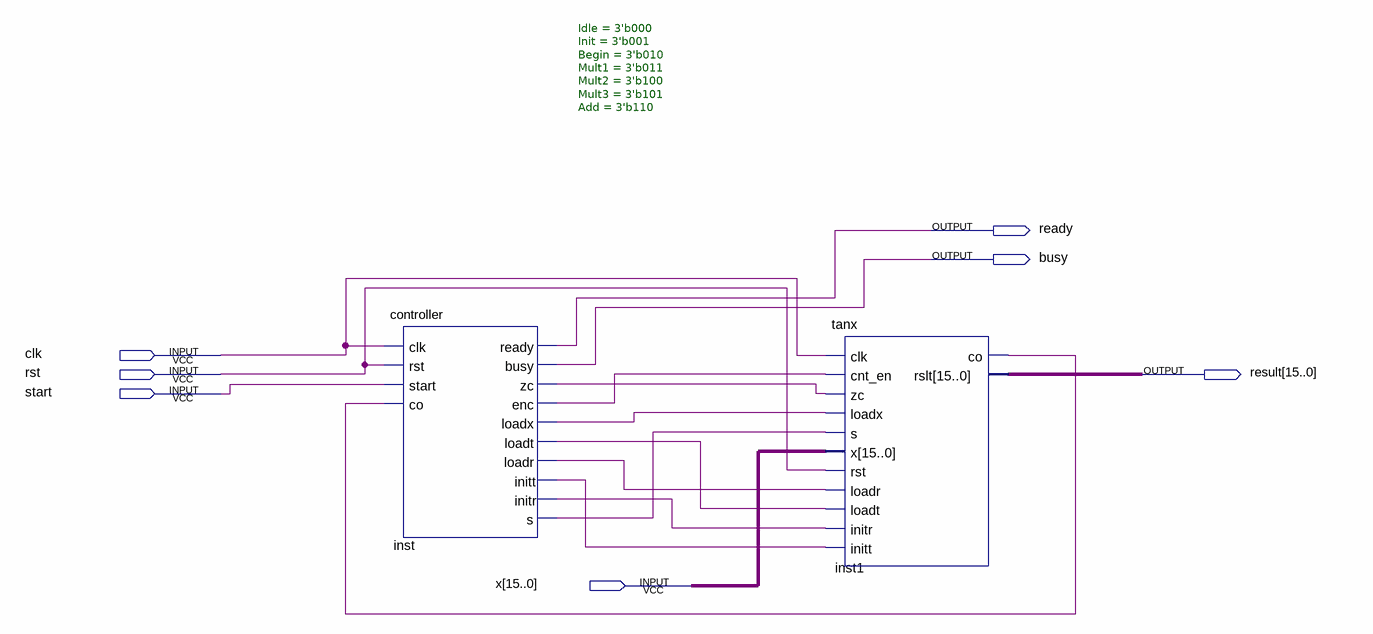
[diagram p0: schematic sheet]
// Quartus schematic RTL.bdf as structural Verilog: 2 symbols, 7 pins
module RTL (
  input  clk,
  input  rst,
  input  start,
  input  [15:0] x,
  output ready,
  output busy,
  output [15:0] result
);

  wire inst1_co, inst_enc, inst_initr, inst_initt, inst_loadr, inst_loadt, inst_loadx, inst_s, inst_zc;

  controller #(.Idle(3'b000), .Init(3'b001), .Begin(3'b010), .Mult1(3'b011), .Mult2(3'b100), .Mult3(3'b101), .Add(3'b110)) inst (
    .clk(clk), .rst(rst), .start(start), .co(inst1_co), .ready(ready), .busy(busy), .zc(inst_zc),
    .enc(inst_enc), .loadx(inst_loadx), .loadt(inst_loadt), .loadr(inst_loadr), .initt(inst_initt),
    .initr(inst_initr), .s(inst_s));
  tanx inst1 (
    .clk(clk), .cnt_en(inst_enc), .zc(inst_zc), .loadx(inst_loadx), .s(inst_s), .x(x), .rst(rst),
    .loadr(inst_loadr), .loadt(inst_loadt), .initr(inst_initr), .initt(inst_initt), .co(inst1_co),
    .rslt(result));
endmodule
